# EasyEDA Pro project 外接板20250808.eprj

# Schematic Schematic1
Board Name: Board1; Create Date: 2025-07-21; Page Name: P1; Project Name: New Project_2025-07-21_10-35-58; Schematic Name: Schematic1; Update Date: 2025-08-07; Company: 嘉立创EDA; Page Size: A4; Version: V1.0
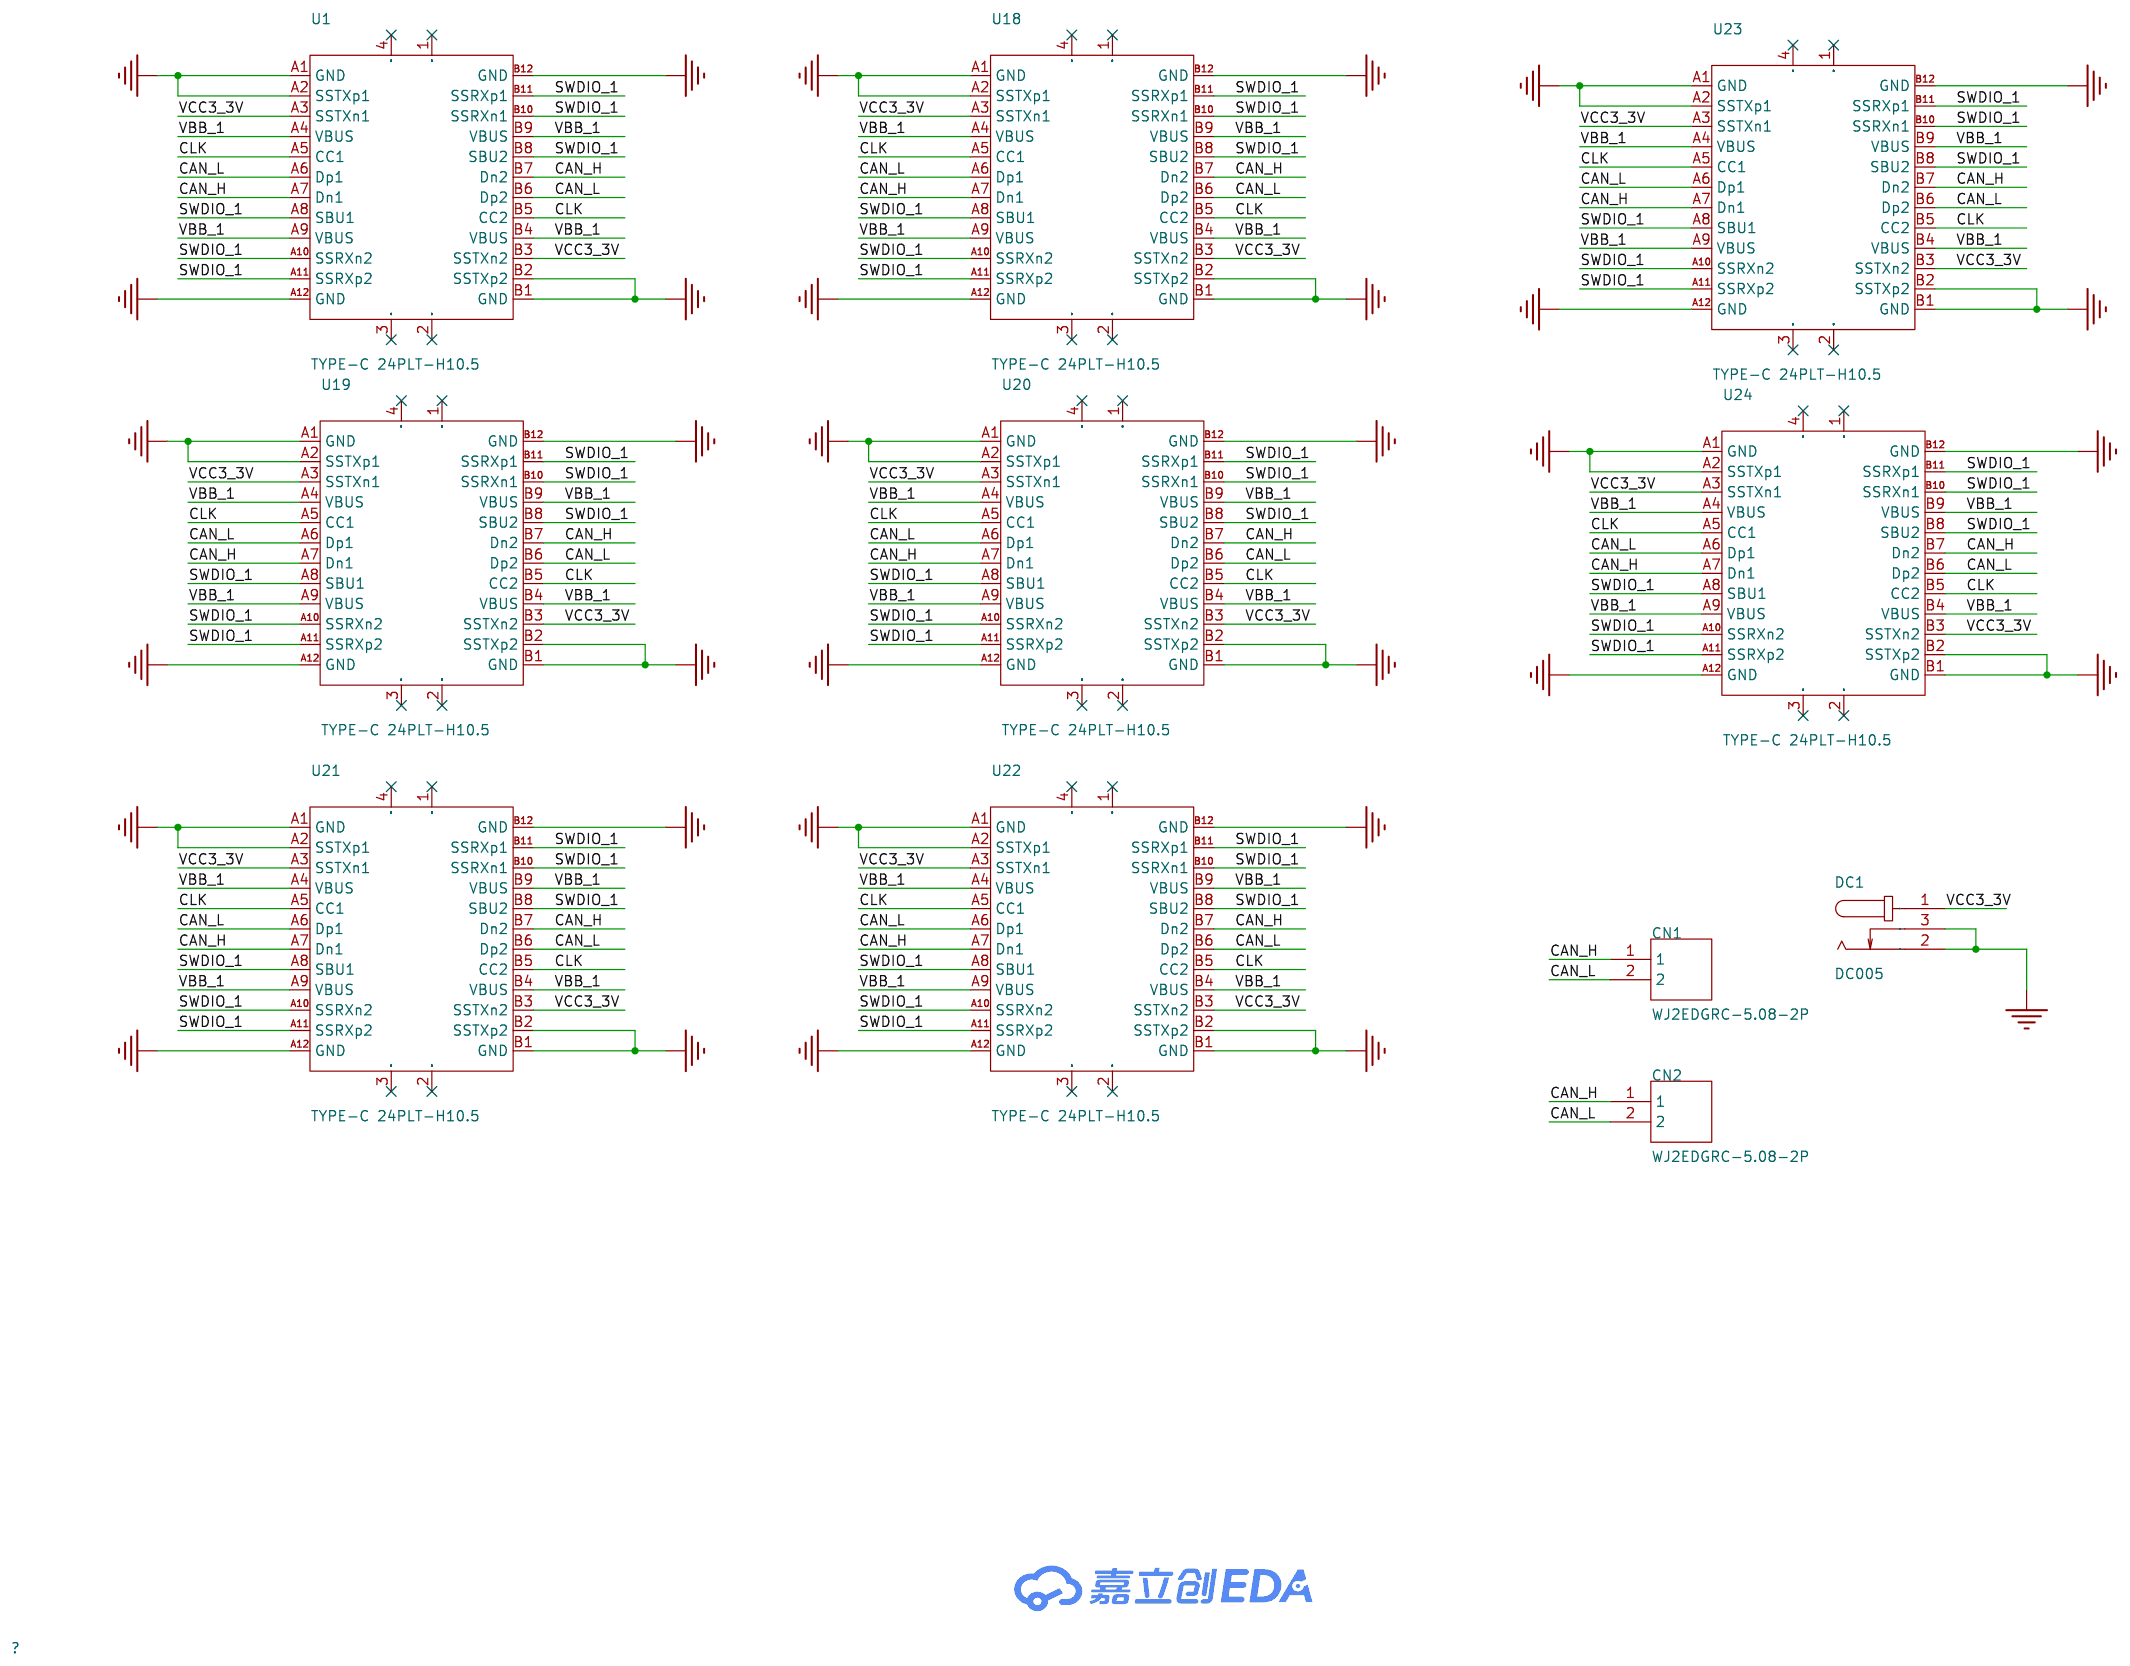
[diagram p0: schematic sheet]

## Parts
CN1  WJ2EDGRC-5.08-2P  [CONN-TH_2P-P5.08_WJ2EDGRC-5.08-2P]
CN2  WJ2EDGRC-5.08-2P  [CONN-TH_2P-P5.08_WJ2EDGRC-5.08-2P]
DC1  DC005  [DC-IN-TH_DC005]
U1  TYPE-C 24PLT-H10.5  [USB-C_TYPE-C-24PLT-H10.5-1]
U18  TYPE-C 24PLT-H10.5  [USB-C_TYPE-C-24PLT-H10.5-1]
U19  TYPE-C 24PLT-H10.5  [USB-C_TYPE-C-24PLT-H10.5-1]
U20  TYPE-C 24PLT-H10.5  [USB-C_TYPE-C-24PLT-H10.5-1]
U21  TYPE-C 24PLT-H10.5  [USB-C_TYPE-C-24PLT-H10.5-1]
U22  TYPE-C 24PLT-H10.5  [USB-C_TYPE-C-24PLT-H10.5-1]
U23  TYPE-C 24PLT-H10.5  [USB-C_TYPE-C-24PLT-H10.5-1]
U24  TYPE-C 24PLT-H10.5  [USB-C_TYPE-C-24PLT-H10.5-1]

## Library data of the parts
CN1 CN2 = WJ2EDGRC-5.08-2P: LCSC Part Name: 1x2P 5.08mm 排数:1 每排P数:2; Supplier Part: C3697; Manufacturer: KANGNEX(康奈克斯电气); Supplier Footprint: 弯插,P=5.08mm; JLCPCB Part Class: 扩展库; Datasheet: https://atta.szlcsc.com/upload/public/pdf/source/20240813/4D8AF133EBD88DD18E5AA0CE5EC77AA3.pdf; Supplier: LCSC; Connector Type: 板端/插座-闭口; Structure: 1x2P; Pitch: 5.08mm; Color: 绿色; Mounting Style: 弯针; Number of Pins: 2P; Number of Rows: 1; Number of PINs Per Row: 2; Current Rating (Max): 20A; Voltage Rating (Max): 450V; Contact Material: 黄铜; Contact Plating: 锡; Operating Temperature Range: -40℃~+105℃
DC1 = DC005: LCSC Part Name: DC电源插座 内径:2mm 外径:6.3mm; Supplier Part: C431533; Manufacturer: SHOU HAN(首韩); Supplier Footprint: 插件; JLCPCB Part Class: 扩展库; Datasheet: https://atta.szlcsc.com/upload/public/pdf/source/20190925/C431533_4751811035784AC1D38EBC85F7905E99.pdf; Supplier: LCSC; Connector Type: DC电源插座; Mounting Style: 弯插; Inside Contact Diameter: 2mm; Outside Contact Diameter: 6.3mm; Current Rating (Max): 500mA; Voltage Rating (Max): 30V; Operating Temperature Range: -25℃~+70℃
U1 U18-U24 = TYPE-C 24PLT-H10.5: LCSC Part Name: Type-C 母 立贴; Supplier Part: C3151750; Manufacturer: SHOU HAN(首韩); Supplier Footprint: SMD; JLCPCB Part Class: 扩展库; Datasheet: https://atta.szlcsc.com/upload/public/pdf/source/20220627/91FAFF0DC2678F248871B59BE141533F.pdf; Supplier: LCSC; Connector Type: Type-C; Standard: USB 3.1; Gender: 母; Mounting Style: 立贴; Number of Contacts: 24P; Number of Ports: 1; Current Rating - Power (Max): 5A; Operating Temperature Range: -40℃~+85℃; Rated Voltage (Max): 20V; Connect-Disconnect Life: 1万次; Core Colour: 黑色

## Nets
GND: DC1.2 DC1.3 U1.A1(GND) U1.A2(SSTXp1) U1.A12(GND) U1.B1(GND) U1.B2(SSTXp2) U1.B12(GND) U18.A1(GND) U18.A2(SSTXp1) U18.A12(GND) U18.B1(GND) U18.B2(SSTXp2) U18.B12(GND) U19.A1(GND) U19.A2(SSTXp1) U19.A12(GND) U19.B1(GND) U19.B2(SSTXp2) U19.B12(GND) U20.A1(GND) U20.A2(SSTXp1) U20.A12(GND) U20.B1(GND) U20.B2(SSTXp2) U20.B12(GND) U21.A1(GND) U21.A2(SSTXp1) U21.A12(GND) U21.B1(GND) U21.B2(SSTXp2) U21.B12(GND) U22.A1(GND) U22.A2(SSTXp1) U22.A12(GND) U22.B1(GND) U22.B2(SSTXp2) U22.B12(GND) U23.A1(GND) U23.A2(SSTXp1) U23.A12(GND) U23.B1(GND) U23.B2(SSTXp2) U23.B12(GND) U24.A1(GND) U24.A2(SSTXp1) U24.A12(GND) U24.B1(GND) U24.B2(SSTXp2) U24.B12(GND)
VCC3_3V: DC1.1 U1.A3(SSTXn1) U1.B3(SSTXn2) U18.A3(SSTXn1) U18.B3(SSTXn2) U19.A3(SSTXn1) U19.B3(SSTXn2) U20.A3(SSTXn1) U20.B3(SSTXn2) U21.A3(SSTXn1) U21.B3(SSTXn2) U22.A3(SSTXn1) U22.B3(SSTXn2) U23.A3(SSTXn1) U23.B3(SSTXn2) U24.A3(SSTXn1) U24.B3(SSTXn2)
CAN_H: CN1.1 CN2.1 U1.A7(Dn1) U1.B7(Dn2) U18.A7(Dn1) U18.B7(Dn2) U19.A7(Dn1) U19.B7(Dn2) U20.A7(Dn1) U20.B7(Dn2) U21.A7(Dn1) U21.B7(Dn2) U22.A7(Dn1) U22.B7(Dn2) U23.A7(Dn1) U23.B7(Dn2) U24.A7(Dn1) U24.B7(Dn2)
CAN_L: CN1.2 CN2.2 U1.A6(Dp1) U1.B6(Dp2) U18.A6(Dp1) U18.B6(Dp2) U19.A6(Dp1) U19.B6(Dp2) U20.A6(Dp1) U20.B6(Dp2) U21.A6(Dp1) U21.B6(Dp2) U22.A6(Dp1) U22.B6(Dp2) U23.A6(Dp1) U23.B6(Dp2) U24.A6(Dp1) U24.B6(Dp2)
CLK: U1.A5(CC1) U1.B5(CC2) U18.A5(CC1) U18.B5(CC2) U19.A5(CC1) U19.B5(CC2) U20.A5(CC1) U20.B5(CC2) U21.A5(CC1) U21.B5(CC2) U22.A5(CC1) U22.B5(CC2) U23.A5(CC1) U23.B5(CC2) U24.A5(CC1) U24.B5(CC2)
SWDIO_1: U1.A8(SBU1) U1.A10(SSRXn2) U1.A11(SSRXp2) U1.B8(SBU2) U1.B10(SSRXn1) U1.B11(SSRXp1) U18.A8(SBU1) U18.A10(SSRXn2) U18.A11(SSRXp2) U18.B8(SBU2) U18.B10(SSRXn1) U18.B11(SSRXp1) U19.A8(SBU1) U19.A10(SSRXn2) U19.A11(SSRXp2) U19.B8(SBU2) U19.B10(SSRXn1) U19.B11(SSRXp1) U20.A8(SBU1) U20.A10(SSRXn2) U20.A11(SSRXp2) U20.B8(SBU2) U20.B10(SSRXn1) U20.B11(SSRXp1) U21.A8(SBU1) U21.A10(SSRXn2) U21.A11(SSRXp2) U21.B8(SBU2) U21.B10(SSRXn1) U21.B11(SSRXp1) U22.A8(SBU1) U22.A10(SSRXn2) U22.A11(SSRXp2) U22.B8(SBU2) U22.B10(SSRXn1) U22.B11(SSRXp1) U23.A8(SBU1) U23.A10(SSRXn2) U23.A11(SSRXp2) U23.B8(SBU2) U23.B10(SSRXn1) U23.B11(SSRXp1) U24.A8(SBU1) U24.A10(SSRXn2) U24.A11(SSRXp2) U24.B8(SBU2) U24.B10(SSRXn1) U24.B11(SSRXp1)
VBB_1: U1.A4(VBUS) U1.A9(VBUS) U1.B4(VBUS) U1.B9(VBUS) U18.A4(VBUS) U18.A9(VBUS) U18.B4(VBUS) U18.B9(VBUS) U19.A4(VBUS) U19.A9(VBUS) U19.B4(VBUS) U19.B9(VBUS) U20.A4(VBUS) U20.A9(VBUS) U20.B4(VBUS) U20.B9(VBUS) U21.A4(VBUS) U21.A9(VBUS) U21.B4(VBUS) U21.B9(VBUS) U22.A4(VBUS) U22.A9(VBUS) U22.B4(VBUS) U22.B9(VBUS) U23.A4(VBUS) U23.A9(VBUS) U23.B4(VBUS) U23.B9(VBUS) U24.A4(VBUS) U24.A9(VBUS) U24.B4(VBUS) U24.B9(VBUS)

Not connected (* = marked no-connect by the designer): U1 1(SHEELD)* 2(SHEELD)* 3(SHEELD)* 4(SHEELD)*; U18 1(SHEELD)* 2(SHEELD)* 3(SHEELD)* 4(SHEELD)*; U19 1(SHEELD)* 2(SHEELD)* 3(SHEELD)* 4(SHEELD)*; U20 1(SHEELD)* 2(SHEELD)* 3(SHEELD)* 4(SHEELD)*; U21 1(SHEELD)* 2(SHEELD)* 3(SHEELD)* 4(SHEELD)*; U22 1(SHEELD)* 2(SHEELD)* 3(SHEELD)* 4(SHEELD)*; U23 1(SHEELD)* 2(SHEELD)* 3(SHEELD)* 4(SHEELD)*; U24 1(SHEELD)* 2(SHEELD)* 3(SHEELD)* 4(SHEELD)*

# Board PCB5
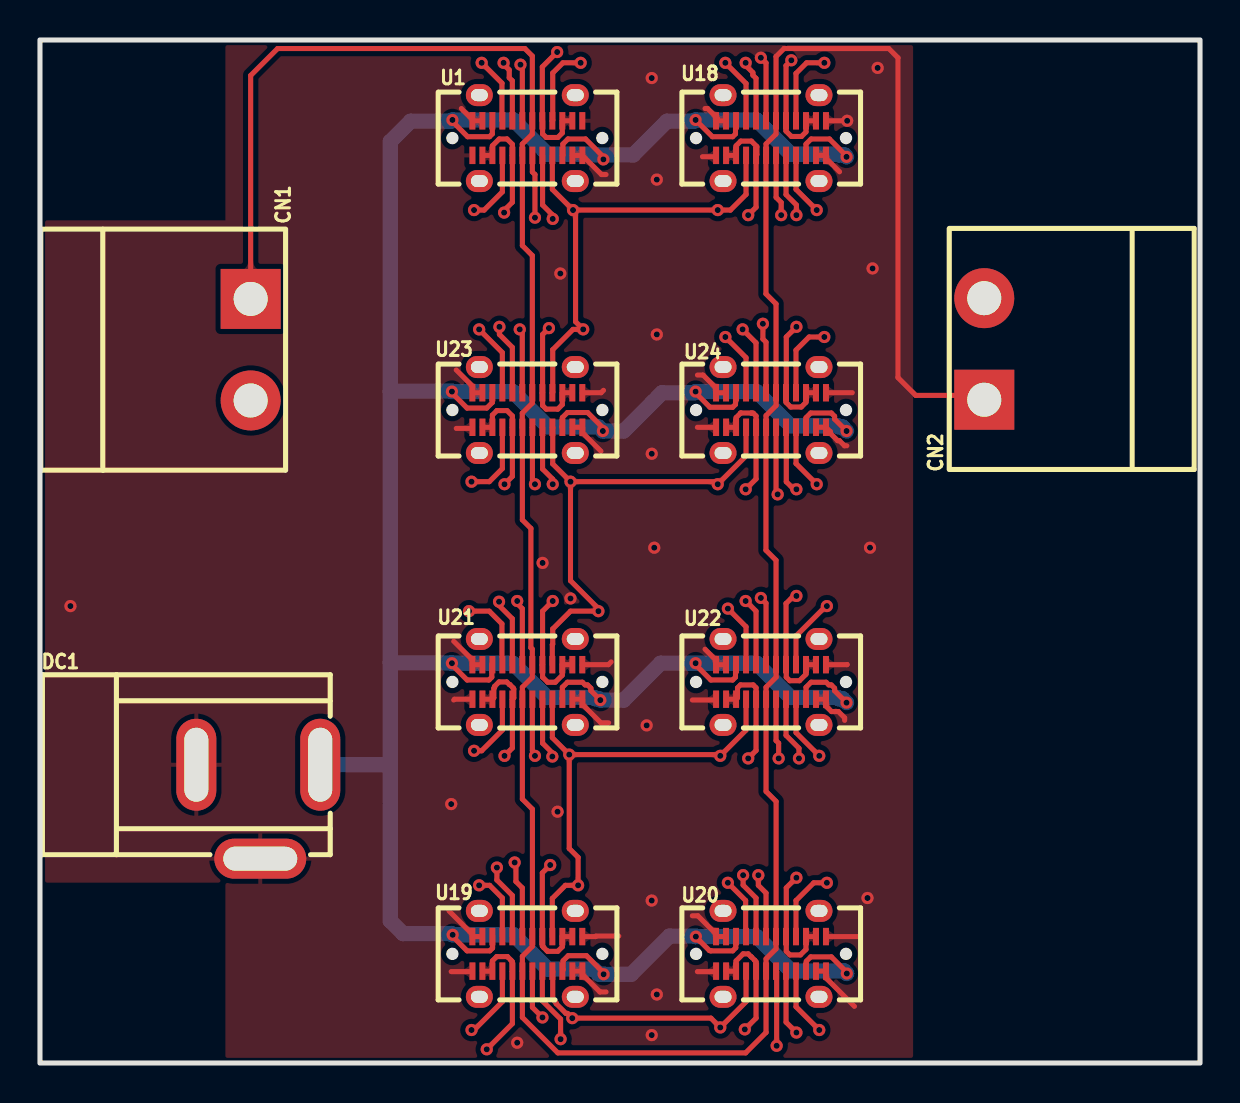
[diagram p1: board, top side]
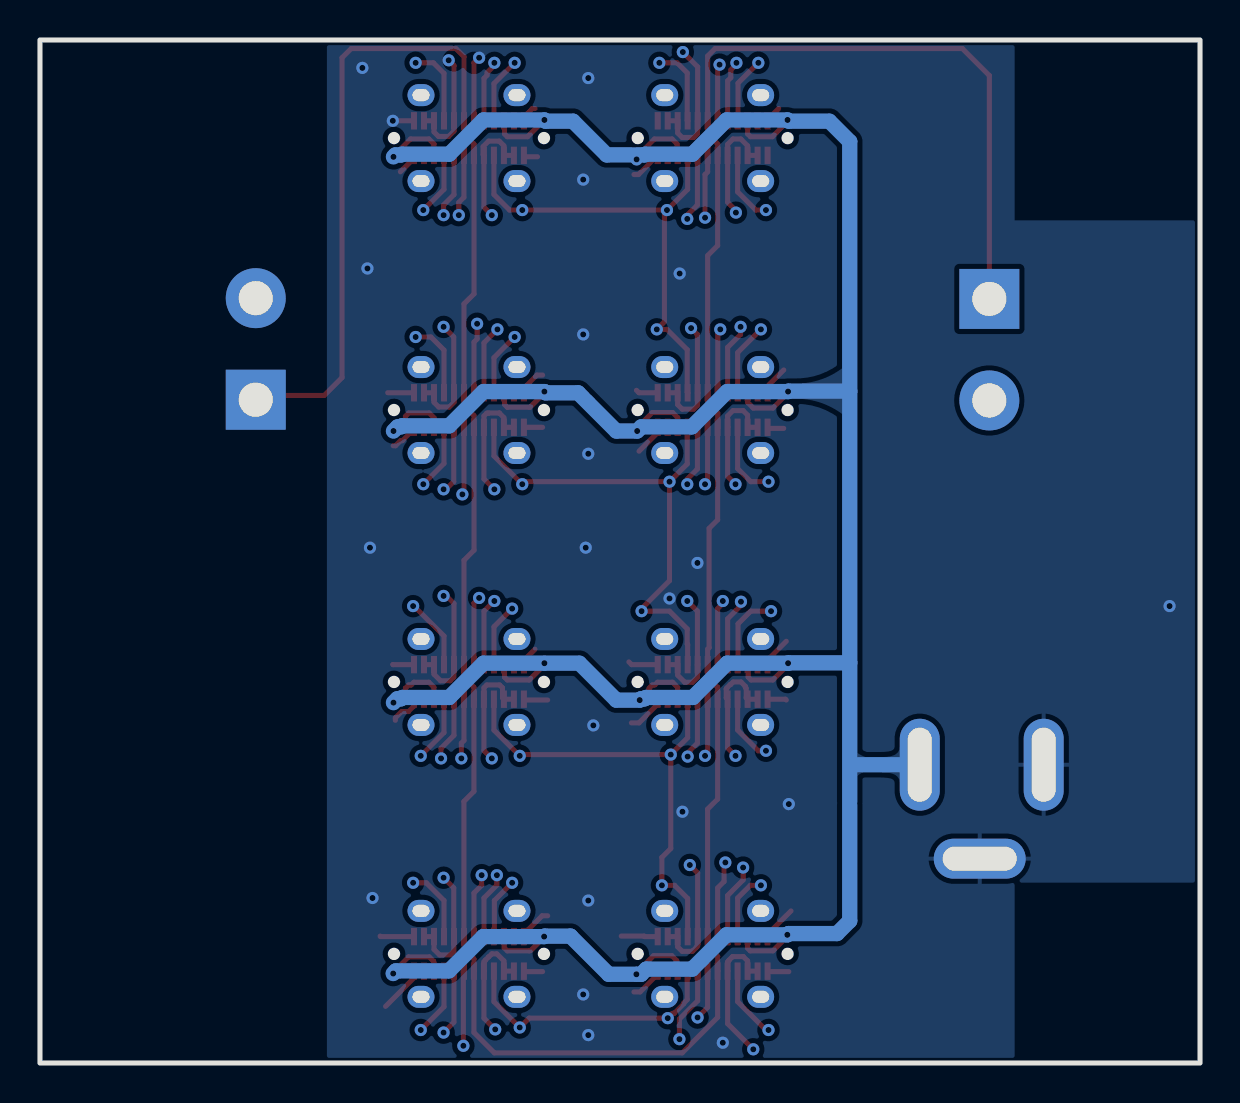
[diagram p2: board, bottom side, seen from below]

Outline 58.04 x 51.18 mm; copper layers: Top Layer, 内层1, 内层2, Inner3, Inner4, Bottom Layer. Coordinates in mm from the lower left corner of the outline.
Outline path: rectangle 0,51.18 58.04,0
Stack: Top Layer 0.035mm 外层铜厚1oz / Dielectric1 0.0994mm 3313 RC57% 4.2mil / 内层1 0.0152mm 内层铜厚 / Dielectric2 0.55mm 0.55mm H/H No copper / 内层2 0.0152mm 内层铜厚 / Dielectric3 0.1088mm 2116 RC54% 4.9mil / Inner3 0.0152mm 内层铜厚 / Dielectric4 0.55mm 0.55mm H/H No copper / Inner4 0.0152mm 内层铜厚 / Dielectric5 0.0994mm 3313 RC57% 4.2mil / Bottom Layer 0.035mm 外层铜厚1oz

## Design rules (mm)
template: JLCPCB Capability(Two Layers Board)
spacing copperThickness1oz (default): track to track 0.102, other pairs 0.152 to 0.3
spacing copperThickness2oz: track to track 0.203, other pairs 0.152 to 0.3
track width copperThickness1oz (default): min 0.127, default 0.254, max 2.54
track width copperThickness2oz: min 0.203, default 0.254, max 2.54
differential pair differentialPair (default): width min 0.127, default 0.254, max 2.54; gap min 0.152, default 0.152
via viaSize (default): diameter min 0.5, default 0.61, max 10; hole min 0.3, default 0.305, max 6.3

## Placement (name value [footprint] x y rotation side)
CN1  WJ2EDGRC-5.08-2P  [CONN-TH_2P-P5.08_WJ2EDGRC-5.08-2P]  10.54 35.69 270 top
CN2  WJ2EDGRC-5.08-2P  [CONN-TH_2P-P5.08_WJ2EDGRC-5.08-2P]  47.24 35.72 90 top
DC1  DC005  [DC-IN-TH_DC005]  10.92 12.57 0 top
U1  TYPE-C 24PLT-H10.5  [USB-C_TYPE-C-24PLT-H10.5-1]  24.38 46.27 0 top
U18  TYPE-C 24PLT-H10.5  [USB-C_TYPE-C-24PLT-H10.5-1]  36.58 46.27 0 top
U19  TYPE-C 24PLT-H10.5  [USB-C_TYPE-C-24PLT-H10.5-1]  24.38 5.46 0 top
U20  TYPE-C 24PLT-H10.5  [USB-C_TYPE-C-24PLT-H10.5-1]  36.58 5.46 0 top
U21  TYPE-C 24PLT-H10.5  [USB-C_TYPE-C-24PLT-H10.5-1]  24.38 19.06 0 top
U22  TYPE-C 24PLT-H10.5  [USB-C_TYPE-C-24PLT-H10.5-1]  36.58 19.06 0 top
U23  TYPE-C 24PLT-H10.5  [USB-C_TYPE-C-24PLT-H10.5-1]  24.38 32.67 0 top
U24  TYPE-C 24PLT-H10.5  [USB-C_TYPE-C-24PLT-H10.5-1]  36.58 32.67 0 top

## Footprints (pads in the part's own frame, mm; a bottom-side part is the same pattern mirrored in y, then rotated)
CONN-TH_2P-P5.08_WJ2EDGRC-5.08-2P
  rect 3x3 hole 1.7: 1(-2.54,0)
  round 3 hole 1.7: 2(2.54,0)
DC-IN-TH_DC005
  oval 2x4.6 hole 1.2x3.7: 1(3.1,2.35) 2(-3.1,2.35)
  oval 4.6x2 hole 3.7x1.2: 3(0.1,-2.35)
USB-C_TYPE-C-24PLT-H10.5-1
  oval 1.35x1.1 hole 0.85x0.6: 1(2.399,2.15) 2(-2.401,2.15) 3(-2.401,-2.15) 4(2.399,-2.15)
  rect 0.3x0.87 smd: A1(-2.751,0.865) A2(-2.251,0.865) A3(-1.751,0.865) A4(-1.251,0.865) A5(-0.751,0.865) A6(-0.251,0.865) A7(0.249,0.865) A8(0.749,0.865) A9(1.249,0.865) A10(1.749,0.865) A11(2.249,0.865) A12(2.749,0.865) B1(2.751,-0.865) B2(2.251,-0.865) B3(1.751,-0.865) B4(1.251,-0.865) B5(0.751,-0.865) B6(0.251,-0.865) B7(-0.249,-0.865) B8(-0.749,-0.865) B9(-1.249,-0.865) B10(-1.749,-0.865) B11(-2.249,-0.865) B12(-2.749,-0.865)

## Nets
As in the schematic.

Pads without a net: U1 1 2 3 4; U18 1 2 3 4; U19 1 2 3 4; U20 1 2 3 4; U21 1 2 3 4; U22 1 2 3 4; U23 1 2 3 4; U24 1 2 3 4

## Via types
v1: diameter 0.61, hole 0.305, Top Layer to Bottom Layer, 117 vias

## Routing (per net, layer and track width the routed paths; a pad name or vN(x,y) marks a point on that pad's centre or on a via; arc(x,y) is an arc through that point)
GND: length 48.4
  Top Layer w0.254: U24.A12 40.64,33.53 ; 28.45,17.02 28.07,17.02 27.14,17.95 U21.B1 U21.B2 ; U21.A2 U21.A1 21.63,20.17 20.7,21.1 ; U24.A2 U24.A1 33.83,33.77 33.17,34.42 32.89,34.42 ; U19.B2 U19.B1 27.14,4.43 28.01,3.56 28.32,3.56 ; U23.B12 21.58,31.75 20.83,31.75 ; U19.B12 21.61,4.57 20.57,4.57 ; U19.A2 U19.A1 21.63,6.44 20.47,7.61 ; U20.A12 41,6.33 41.02,6.35 ; U20.B2 U20.B1 39.33,4.26 40.75,2.83 ; 28.19,33.65 28.07,33.53 U23.A12 ; U21.B12 20.74,18.2 20.7,18.16 ; 32.89,4.57 33.8,4.57 U20.B12 ; 40,44.59 39.33,45.26 U18.B1 U18.B2 ; U22.A12 40.38,19.93 40.39,19.94 ; U1.B2 U1.B1 28.09,44.45 28.32,44.45 ; U22.A2 U22.A1 33.83,20.15 33.27,20.7 ; U21.A12 28.44,19.93 28.58,20.07 ; U18.B12 33.76,45.34 33.15,45.34 ; 21.08,47.75 21.63,47.2 U1.A1 U1.A2 ; U22.B12 33.79,18.16 32.64,18.16 ; 40.26,17.14 40.26,17.27 39.94,17.58 39.6,17.58 39.33,17.86 U22.B1 U22.B2 ; 40.37,30.88 40.25,30.88 40,31.13 39.91,31.13 39.54,31.5 39.54,31.59 U24.B1 U24.B2 ; U23.A2 U23.A1 21.63,33.87 20.83,34.67 ; U24.B12 32.89,31.8 ; 28.96,6.35 27.81,6.35 27.79,6.33 U19.A12 ; U23.B2 U23.B1 27.14,31.54 28.07,30.61 ; 33.27,47.75 33.4,47.75 33.89,47.26 33.89,47.2 U18.A1 U18.A2 ; 32.64,7.37 32.91,7.37 33.83,6.46 U20.A1 U20.A2 ; U18.A12 v1(40.39,47.14)
  vias: v1(1.52,22.86) v1(20.57,12.95) v1(23.88,1.02) v1(25.15,25.02) v1(25.9,12.57) v1(26.03,39.5) v1(26.54,23.24) v1(30.35,16.89) v1(30.61,49.28) v1(30.61,30.48) v1(30.61,8.13) v1(30.61,1.4) v1(30.73,25.78) v1(30.86,44.2) v1(30.86,36.45) v1(30.86,3.43) v1(41.4,8.25) v1(41.53,25.78) v1(41.66,39.75) v1(41.91,49.78)
VCC3_3V: length 192.3
  Top Layer w0.254: 34.8,19.96 34.8,19.3 34.66,19.16 33.56,19.16 32.8,19.92 v1(32.8,20) ; v1(32.82,6.32) 32.82,6.29 33.01,6.1 33.02,6.1 33.49,5.63 33.55,5.63 33.56,5.61 34.66,5.61 34.81,5.77 34.81,6.28 ; 26.11,18.23 26.14,18.26 26.14,18.8 26.39,19.05 27.14,19.05 27.28,18.91 27.4,18.91 27.56,18.75 27.56,18.63 v1(28.03,18.16) ; 34.8,33.55 34.8,32.95 34.66,32.81 33.52,32.81 32.8,33.52 v1(32.8,33.59) ; 38.3,45.41 38.33,45.43 38.33,45.97 38.58,46.23 39.5,46.23 40.35,45.37 v1(40.35,45.33) ; 22.61,19.96 22.61,19.3 22.47,19.16 21.37,19.16 20.61,19.92 v1(20.61,20) ; 26.11,31.82 26.14,31.85 26.14,32.29 26.39,32.54 27.4,32.54 28.16,31.78 v1(28.16,31.62) ; v1(40.35,18.03) 39.76,18.63 39.76,18.75 39.59,18.91 39.47,18.91 39.33,19.05 38.58,19.05 38.33,18.8 38.33,18.26 38.3,18.23 ; 38.31,4.55 38.34,4.58 38.34,5.09 38.56,5.31 39.59,5.31 40.37,4.54 v1(40.37,4.48) ; U23.A3 22.63,33.05 22.35,32.77 21.37,32.77 20.61,33.52 v1(20.61,33.59) ; 34.8,47.14 34.8,46.48 34.66,46.34 33.64,46.34 v1(32.8,47.18) ; U1.B3 26.16,45.43 26.16,45.97 26.42,46.23 27.29,46.23 28.19,45.33 v1(28.19,45.21) ; 38.3,31.82 38.33,31.85 38.33,32.28 38.56,32.52 39.59,32.52 39.76,32.35 39.76,32.22 v1(40.35,31.62) ; U1.A3 22.63,46.48 22.49,46.34 21.4,46.34 20.64,47.1 v1(20.64,47.18) ; v1(28.2,4.44) 28.2,4.51 27.34,5.37 26.43,5.37 26.17,5.11 26.17,4.67 26.15,4.64 ; v1(20.65,6.41) 20.65,6.33 21.37,5.61 22.5,5.61 22.64,5.75 22.64,6.37
  Bottom Layer w0.762: v1(40.35,31.62) 40.15,31.83 39.98,31.83 39.93,31.88 37.56,31.88 35.85,33.59 v1(32.8,33.59) 32.74,33.53 31.11,33.53 29.2,31.62 v1(28.16,31.62) 27.95,31.83 25.42,31.83 23.66,33.59 v1(20.61,33.59) 20.59,33.61 17.53,33.61 ; 17.53,13.08 17.53,20.02 ; 17.53,20.02 17.53,33.61 ; 17.53,20.02 20.6,20.02 v1(20.61,20) 23.66,20 25.37,18.29 27.72,18.29 27.79,18.22 27.97,18.22 v1(28.03,18.16) 29.2,18.16 31.05,20 v1(32.8,20) 35.85,20 37.56,18.29 39.91,18.29 39.98,18.22 40.16,18.22 v1(40.35,18.03) ; 17.53,33.61 17.53,46.1 18.54,47.12 20.57,47.12 v1(20.64,47.18) 23.69,47.18 25.4,45.47 27.75,45.47 27.78,45.43 28.19,45.43 ; 14.02,14.92 17.14,14.92 ; 17.53,12.89 17.53,7.11 18.16,6.48 20.58,6.48 v1(20.65,6.41) 23.7,6.41 25.41,4.7 27.7,4.7 27.96,4.44 v1(28.2,4.44) 29.59,4.44 31.5,6.35 32.79,6.35 v1(32.82,6.32) 35.86,6.32 37.58,4.61 40.23,4.61 v1(40.37,4.48) ; 28.41,45.43 29.68,45.43 31.37,47.12 32.74,47.12 v1(32.8,47.18) 35.85,47.18 37.56,45.47 39.94,45.47 39.98,45.43 40.26,45.43 v1(40.35,45.33)
CAN_H: length 166.4
  Top Layer w0.254: CN2.1 47.03,33.4 43.81,33.4 42.93,34.29 42.93,50.29 42.46,50.75 37.23,50.75 36.83,50.35 U18.A7 36.83,46.48 36.33,45.98 U18.B7 36.32,45.4 36.32,38.48 36.83,37.98 U24.A7 36.83,33.53 36.83,32.89 36.33,32.39 U24.B7 36.32,31.8 36.32,25.65 36.83,25.15 U22.A7 36.83,19.92 36.83,19.3 36.33,18.8 U22.B7 36.33,13.59 36.83,13.09 36.83,6.33 U20.A7 36.83,5.71 36.33,5.21 U20.B7 36.33,1.53 35.31,0.51 25.91,0.51 24.14,2.28 U19.B7 24.14,5.34 24.63,5.84 U19.A7 24.64,6.33 24.64,12.7 24.14,13.2 U21.B7 24.14,18.8 24.63,19.3 U21.A7 24.63,20.71 24.56,20.78 24.56,26.75 24.14,27.17 U23.B7 24.13,31.81 24.13,32.51 24.63,33.01 U23.A7 24.63,40.4 24.14,40.89 U1.B7 24.13,45.41 24.13,45.97 24.63,46.48 U1.A7 24.63,50.38 24.26,50.75 11.89,50.75 10.54,49.4 CN1.1
CAN_L: length 220.8
  Top Layer w0.254: U18.A6 36.33,50.03 v1(36.07,50.29) ; U22.A6 36.33,23.01 v1(36.07,23.27) ; v1(24,36.7) 24.13,36.58 24.13,33.54 U23.A6 ; U24.B6 36.83,28.53 v1(36.91,28.45) ; v1(36.96,15.24) 36.96,16 36.83,16.13 U22.B6 ; v1(24.77,15.37) 24.77,15.49 24.64,15.62 U21.B6 ; v1(24.77,28.96) 24.64,29.08 24.64,31.8 U23.B6 ; v1(25.14,2.28) 24.64,2.78 24.64,4.59 U19.B6 ; v1(37.08,42.42) 37.08,43.05 36.83,43.31 36.83,45.4 U18.B6 ; v1(36.86,0.86) 36.86,4.57 U20.B6 ; v1(36.17,36.98) 36.17,36.22 36.33,36.06 U24.A6 ; U1.A6 24.13,49.85 v1(24.04,49.95) ; v1(23.75,10.03) 23.81,9.97 23.81,9.08 24.13,8.76 U19.A6 ; U20.A6 36.33,8.51 35.94,8.89 v1(35.94,9.4) ; U1.B6 24.64,44.58 24.77,44.45 v1(24.77,42.29) ; U21.A6 24.13,22.73 23.88,22.99 v1(23.88,23.11)
  内层2 w0.254: 24.13,36.83 24.13,40.26 24.77,40.89 v1(24.77,42.29) 24.64,42.42 24.64,46.1 24.04,46.7 v1(24.04,49.95) 24.04,50.08 23.37,50.75 14.69,50.75 13.72,49.78 13.72,34.04 12.83,33.15 CN1.2 ; CN2.2 43.65,38.26 42.93,38.99 42.93,50.29 42.47,50.75 36.52,50.75 v1(36.07,50.29) 36.07,46.99 37.08,45.97 v1(37.08,42.42) 37.08,38.99 36.17,38.07 v1(36.17,36.98) 36.17,32.79 36.91,32.05 v1(36.91,28.45) 36.89,28.44 36.89,26.73 36.07,25.91 v1(36.07,23.27) 35.94,23.14 35.94,19.56 36.96,18.54 v1(36.96,15.24) 37.02,15.18 37.02,13.91 36.07,12.95 36.07,9.52 v1(35.94,9.4) 36.02,9.32 36.02,5.92 36.86,5.08 v1(36.86,0.86) 36.58,0.58 25.33,0.58 25.15,0.76 25.15,2.27 v1(25.14,2.28) 25.14,4.7 23.75,6.1 v1(23.75,10.03) 23.75,12.19 24.77,13.21 v1(24.77,15.37) 24.77,18.54 23.81,19.49 23.81,23.05 v1(23.88,23.11) 24,23.24 24,26.67 24.77,27.43 v1(24.77,28.96) 24.77,32.13 24,32.89 v1(24,36.7)
CLK: length 186.5
  Top Layer w0.254: U1.B5 25.15,45.4 25.15,42.93 25.65,42.42 v1(25.65,42.23) ; v1(37.85,28.7) 37.72,28.7 37.34,29.08 37.34,31.79 U24.B5 ; U22.A5 35.83,22.61 35.32,23.11 v1(35.31,23.11) ; v1(22.86,9.78) 22.86,9.15 23.63,8.38 U19.A5 ; v1(37.85,1.52) 37.33,2.04 U20.B5 ; 23.19,49.97 23.48,49.68 23.48,49.29 23.63,49.14 U1.A5 ; v1(22.99,36.83) 22.99,36.45 23.63,35.8 U23.A5 ; v1(35.31,50.04) 35.31,49.91 35.67,49.55 35.67,49.42 35.83,49.26 U18.A5 ; U20.A5 35.83,8.25 35.18,8.9 v1(35.18,9.4) ; v1(37.97,15.24) 37.97,15.75 37.33,16.39 U22.B5 ; U21.B5 25.15,18.19 25.15,16 25.64,15.51 v1(25.64,15.33) ; U21.A5 23.63,22.22 22.97,22.89 v1(22.97,23.08) ; U23.B5 25.15,31.79 25.15,29.72 25.65,29.21 v1(25.65,28.96) ; v1(35.15,36.7) 35.83,36.03 U24.A5 ; U18.B5 37.33,43.44 37.85,42.93 v1(37.85,42.42) ; v1(26.05,1.19) 26.05,2.2 25.14,3.11 U19.B5
  内层1 w0.254: 23.19,49.97 23.19,48.94 23.62,48.51 23.62,46.74 24,46.35 24.77,46.35 25.15,45.97 25.15,42.93 25.65,42.42 v1(25.65,42.23) 25.65,40.13 25.15,39.62 23.62,39.62 22.99,38.99 v1(22.99,36.83) 22.99,34.04 25.65,31.37 v1(25.65,28.96) 25.65,27.05 25.27,26.67 23.49,26.67 22.99,26.16 22.99,23.1 v1(22.97,23.08) 22.97,20.41 25.64,17.74 v1(25.64,15.33) 25.64,13.32 25.27,12.95 23.37,12.95 22.86,12.45 v1(22.86,9.78) 24.38,8.25 24.38,2.16 25.35,1.19 v1(26.05,1.19) 26.72,1.19 27.94,2.41 36.07,2.41 36.25,2.23 36.25,1.65 36.43,1.47 37.79,1.47 v1(37.85,1.52) 37.85,3.94 35.18,6.6 v1(35.18,9.4) 35.18,11.81 35.69,12.32 37.59,12.32 38.04,12.76 38.04,15.18 v1(37.97,15.24) 37.97,17.65 35.31,20.32 v1(35.31,23.11) 35.31,25.53 35.56,25.78 37.46,25.78 37.85,26.16 v1(37.85,28.7) 37.85,31.11 35.15,33.81 v1(35.15,36.7) 35.31,36.86 35.31,38.73 35.94,39.37 37.34,39.37 37.85,39.88 v1(37.85,42.42) 37.85,44.83 35.31,47.37 v1(35.31,50.04)
  vias: v1(23.19,50.04)
SWDIO_1: length 238.5
  Top Layer w0.254: v1(35.43,15.24) 35.83,15.63 U22.B8 35.83,18.77 35.69,18.91 35.04,18.91 34.9,18.77 34.9,18.27 U22.B10 U22.B11 ; v1(25.46,36.77) 25.15,36.45 25.15,33.55 U23.A8 25.15,33.52 25.15,32.89 25.33,32.71 25.91,32.71 26.13,32.94 U23.A10 U23.A11 ; v1(22.35,0.69) 23.64,1.97 U19.B8 23.64,5.07 23.56,5.14 23.56,5.15 23.4,5.31 23.39,5.31 23.38,5.33 22.85,5.33 22.64,5.11 U19.B10 U19.B11 ; v1(37.85,36.83) 37.34,36.32 37.34,33.55 U24.A8 37.33,33.05 37.56,32.82 38.09,32.82 38.33,33.05 U24.A10 U24.A11 ; U18.A11 U18.A10 38.33,46.58 38.1,46.35 37.59,46.35 37.33,46.62 U18.A8 37.33,49.9 v1(37.59,50.16) ; U21.B11 U21.B10 22.71,18.27 22.71,18.75 22.75,18.79 22.75,18.84 22.97,19.06 23.35,19.06 23.49,18.93 23.51,18.93 23.68,18.77 23.68,18.74 23.71,18.71 23.71,18.27 U21.B8 23.64,15.76 v1(23.24,15.37) ; v1(37.85,23.37) 37.71,23.37 37.33,22.99 U22.A8 37.34,19.92 37.34,19.3 37.52,19.12 38,19.12 38.33,19.45 U22.A10 U22.A11 ; U20.A11 U20.A10 38.33,5.69 38.05,5.41 37.52,5.41 37.34,5.59 37.34,6.31 U20.A8 37.34,6.34 37.34,8.76 v1(37.85,9.27) ; v1(25.88,50.58) 25.13,49.83 U1.A8 25.15,47.12 25.15,46.48 25.33,46.3 25.91,46.3 26.13,46.53 U1.A10 U1.A11 ; U21.A11 U21.A10 26.13,19.4 25.78,19.05 25.4,19.05 25.15,19.3 25.15,19.92 U21.A8 25.15,19.94 25.15,22.61 v1(25.65,23.11) ; v1(23.22,42.54) 23.22,42.65 23.64,43.07 U1.B8 23.64,45.96 23.37,46.23 22.98,46.23 22.64,45.89 U1.B10 U1.B11 ; U19.A11 U19.A10 26.13,5.81 25.91,5.59 25.4,5.59 25.38,5.61 25.37,5.61 25.2,5.78 25.2,5.78 25.13,5.85 U19.A8 25.13,9.51 v1(25.53,9.91) ; v1(35.26,1.68) 35.83,2.25 U20.B8 35.83,5.07 35.76,5.14 35.76,5.15 35.59,5.31 35.58,5.31 35.43,5.46 35.18,5.46 34.83,5.11 U20.B10 U20.B11 ; v1(23.24,28.96) 23.64,29.35 U23.B8 23.64,32.37 23.37,32.64 22.86,32.64 22.64,32.41 U23.B10 U23.B11 ; v1(35.31,28.7) 35.83,29.22 U24.B8 35.83,32.37 35.69,32.51 35.6,32.51 35.59,32.52 35.06,32.52 35.06,32.51 35.05,32.51 34.83,32.29 U24.B10 U24.B11 ; v1(35.43,42.42) 35.83,42.81 U18.B8 35.87,45.45 35.87,45.85 35.59,46.12 35.06,46.12 34.83,45.89 U18.B10 U18.B11
  Inner3 w0.254: v1(37.59,50.16) 37.59,46.86 36.96,46.23 35.94,46.23 35.5,45.78 35.5,42.48 v1(35.43,42.42) 35.43,39.88 35.81,39.5 37.46,39.5 37.85,39.12 v1(37.85,36.83) 37.85,33.27 37.59,33.02 35.94,33.02 35.31,32.38 v1(35.31,28.7) 35.38,28.63 35.38,26.21 35.56,26.03 37.08,26.03 37.85,25.27 v1(37.85,23.37) 37.77,23.29 37.77,19.36 37.59,19.18 35.69,19.18 35.43,18.92 v1(35.43,15.24) 35.51,15.17 35.51,12.5 35.69,12.32 37.21,12.32 37.85,11.68 v1(37.85,9.27) 37.9,9.22 37.9,5.51 37.72,5.33 35.69,5.33 35.31,4.95 35.31,1.73 v1(35.26,1.68) 35.26,1.1 34.59,0.43 22.61,0.43 v1(22.35,0.69) 23.3,1.64 23.3,4.89 23.75,5.33 25.02,5.33 25.53,5.84 v1(25.53,9.91) 25.53,11.94 25.02,12.45 23.75,12.45 23.24,12.95 v1(23.24,15.37) 23.32,15.44 23.32,18.87 23.49,19.05 25.27,19.05 25.65,19.43 v1(25.65,23.11) 25.78,23.24 25.78,26.29 25.58,26.49 23.42,26.49 23.24,26.67 v1(23.24,28.96) 23.24,32.51 23.42,32.69 25.2,32.69 25.46,32.96 v1(25.46,36.77) 25.46,39.05 25.02,39.5 23.62,39.5 23.24,39.88 23.24,42.52 v1(23.22,42.54) 23.62,42.95 23.62,46.05 23.88,46.3 24.97,46.3 25.83,47.17 25.83,50.53 v1(25.88,50.58)
VBB_1: length 299.7
  Top Layer w0.254: U20.A4 35.31,6.34 35.31,8.13 v1(34.42,9.02) ; v1(34.29,50.04) 35.33,49 U18.A4 ; v1(26.48,15.43) 26.48,10.73 26.92,10.29 v1(26.92,8.89) 26.29,8.89 25.63,8.23 U19.A9 ; v1(26.48,15.43) 25.64,16.27 U21.B4 ; v1(26.48,15.43) 33.97,15.43 v1(34.04,15.37) 35.33,16.66 U22.B9 ; U19.B9 23.14,3.07 21.72,1.65 v1(21.59,1.65) ; v1(39.37,9.02) 38.71,9.02 37.83,8.13 U20.A9 ; U20.B9 35.33,3.07 v1(34.04,1.78) 33.57,2.25 v1(26.63,2.25) 26.39,2.48 26.31,2.48 25.83,2.97 25.83,3 25.65,3.17 25.65,4.58 U19.B4 ; U1.A9 25.65,47.16 25.65,49.53 26.16,50.04 v1(27.05,50.04) ; v1(21.59,29.08) 22.48,29.08 23.14,29.74 U23.B9 ; v1(39.24,50.04) 38.35,50.04 37.83,49.51 U18.A9 ; v1(26.67,42.67) v1(33.91,42.67) 34.54,42.67 35.33,43.45 U18.B9 ; v1(26.67,42.67) 25.64,43.71 U1.B4 ; v1(26.67,42.67) 26.8,42.54 26.8,37.08 v1(27.18,36.7) 26.67,36.7 25.65,35.69 25.65,33.55 U23.A9 ; v1(22.1,50.04) 23.11,49.02 23.11,47.16 U1.A4 ; v1(34.29,36.32) 35.33,35.29 U24.A4 ; U19.A4 23.13,8.25 22.5,8.89 v1(21.97,8.89) ; U20.B4 37.83,2.81 v1(38.99,1.65) ; U1.B9 23.14,43.58 22.23,42.67 v1(21.72,42.67) ; v1(26.54,29.08) 33.78,29.08 v1(33.91,28.96) 35.33,30.37 U24.B9 ; v1(26.54,29.08) 25.65,29.97 25.65,31.78 U23.B4 ; v1(26.54,29.08) 26.54,24.13 27.94,22.73 v1(27.94,22.61) 26.54,22.61 25.65,21.72 25.65,20.95 25.63,20.93 U21.A9 ; U22.B4 37.83,16.53 v1(38.99,15.37) ; v1(38.86,42.67) 37.83,43.71 U18.B4 ; v1(21.72,15.62) 22.1,15.62 23.14,16.66 U21.B9 ; v1(21.46,22.61) 22.48,22.61 23.11,21.97 23.11,20.32 ; U23.A4 23.13,35.54 v1(21.97,36.7) ; U22.A4 35.33,21.82 v1(34.42,22.73) ; v1(39.37,22.86) 39.32,22.86 37.83,21.36 U22.A9 ; v1(38.86,28.96) 37.83,29.99 U24.B4 ; U24.A9 37.83,35.67 38.48,36.32 v1(39.24,36.32)
  Inner4 w0.254: v1(34.04,1.78) 34.67,2.41 36.74,2.41 36.87,2.29 ; v1(26.54,29.08) 25.78,29.84 24.19,29.84 ; v1(26.67,42.67) 26.03,43.31 24.41,43.31 24.4,43.32 ; 24.17,35.69 25.78,35.69 26.54,36.45 27.18,36.45 ; 24.17,35.69 24.19,35.66 24.19,29.84 ; 24.17,35.69 22.99,35.69 v1(21.97,36.7) ; 23.42,1.65 25.53,1.65 26.12,2.25 v1(26.63,2.25) ; 23.42,1.65 v1(21.59,1.65) ; 23.42,1.65 23.42,8.89 ; v1(34.29,36.32) 34.92,35.69 36.84,35.69 ; 24.19,29.84 23.11,29.84 22.35,29.08 v1(21.59,29.08) ; 36.72,43.18 36.75,43.21 36.75,49.28 ; 36.72,43.18 38.35,43.18 v1(38.86,42.67) ; 36.72,43.18 34.54,43.18 34.04,42.67 v1(33.91,42.67) ; 24.47,16.26 22.73,16.26 22.1,15.62 v1(21.72,15.62) ; 24.47,16.26 25.65,16.26 v1(26.48,15.43) ; 24.47,16.26 24.45,16.28 24.45,21.72 ; v1(38.99,15.37) 37.97,16.38 36.97,16.38 ; v1(21.72,42.67) 21.97,42.67 22.61,43.31 24.39,43.31 24.4,43.32 ; 24.45,21.72 25.65,21.72 26.54,22.61 v1(27.94,22.61) ; 24.45,21.72 23.24,21.72 22.35,22.61 v1(21.46,22.61) ; 36.97,21.97 35.18,21.97 v1(34.42,22.73) ; 36.97,21.97 36.97,16.38 ; 36.97,21.97 38.43,21.97 39.32,22.86 v1(39.37,22.86) ; v1(38.99,1.65) 38.35,2.29 36.87,2.29 ; 36.97,16.38 35.31,16.38 34.29,15.37 v1(34.04,15.37) ; 24.4,43.32 24.4,49.02 ; v1(39.24,50.04) 38.48,49.28 36.75,49.28 ; 36.84,35.69 38.61,35.69 v1(39.24,36.32) ; 36.84,35.69 36.84,34.92 36.7,34.79 36.7,29.46 ; 36.75,49.28 35.05,49.28 v1(34.29,50.04) ; 36.87,2.29 36.87,8.49 36.89,8.51 ; v1(22.1,50.04) 23.11,49.02 24.4,49.02 ; 24.4,49.02 25.53,49.02 26.42,49.91 26.92,49.91 v1(27.05,50.04) ; 36.7,29.46 38.35,29.46 v1(38.86,28.96) ; 36.7,29.46 34.67,29.46 34.16,28.96 v1(33.91,28.96) ; 36.89,8.51 34.92,8.51 v1(34.42,9.02) ; 36.89,8.51 38.86,8.51 v1(39.37,9.02) ; 23.42,8.89 v1(21.97,8.89) ; 23.42,8.89 v1(26.92,8.89)

## Copper pours and planes (outline as drawn; the poured copper is in the pictures)
GND on Top Layer: -1.14,52.7 47.24,52.7 47.24,-3.05 -1.14,-3.05
GND on Bottom Layer: -1.4,52.2 46.36,52.2 46.36,-2.16 -1.4,-2.16
GND on 内层1: -0.89,52.32 46.36,52.32 46.36,-2.16 -0.89,-2.16
GND on 内层2: -2.41,53.21 49.02,53.21 49.02,-3.94 -2.41,-3.94
GND on Inner3: -4.06,54.36 46.74,54.36 46.74,-1.65 -4.06,-1.65
GND on Inner4: -2.03,52.7 44.96,52.7 44.96,-1.02 -2.03,-1.02

Small or netless copper shapes (teardrops, artwork), in the pictures only: 174 on Top Layer, 4 on Bottom Layer, 30 on 内层1, 31 on 内层2, 29 on Inner3, 47 on Inner4
